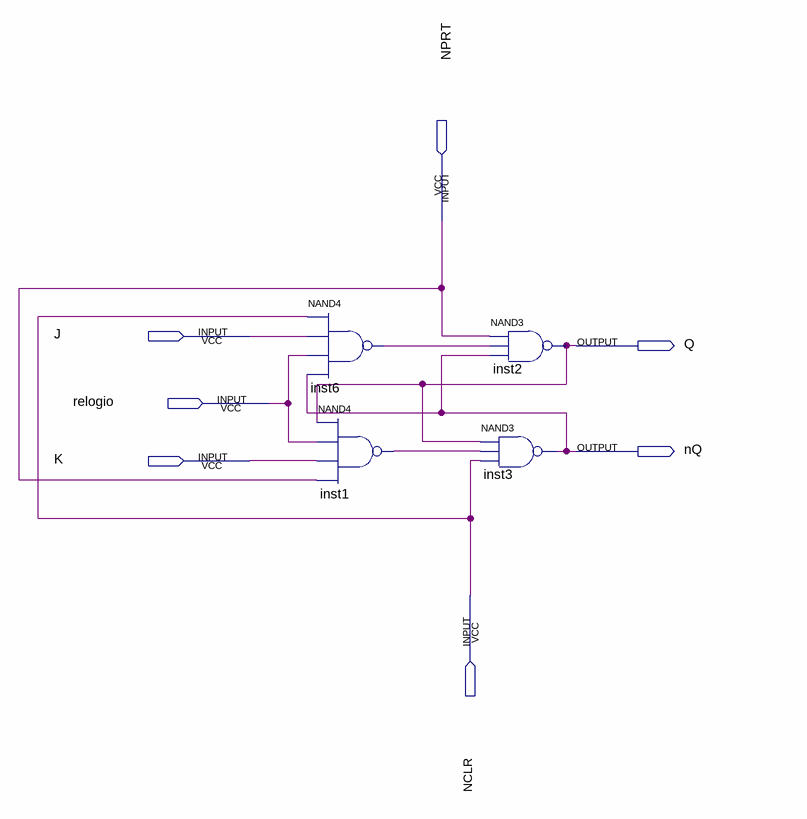
[diagram p0: schematic sheet]
// Quartus schematic flipflop_jk.bdf as structural Verilog: 4 symbols, 7 pins
module flipflop_jk (
  input  NPRT,
  input  J,
  input  relogio,
  input  K,
  input  NCLR,
  output Q,
  output nQ
);

  wire inst1_out, inst6_out;

  nand inst6 (inst6_out, NCLR, J, relogio, nQ);
  nand inst1 (inst1_out, Q, relogio, K, NPRT);
  nand inst2 (Q, NPRT, inst6_out, nQ);
  nand inst3 (nQ, Q, inst1_out, NCLR);
endmodule
